# Altium schematic sheet 05-VIDEO_TEST_PATTERN.SchDoc
size B
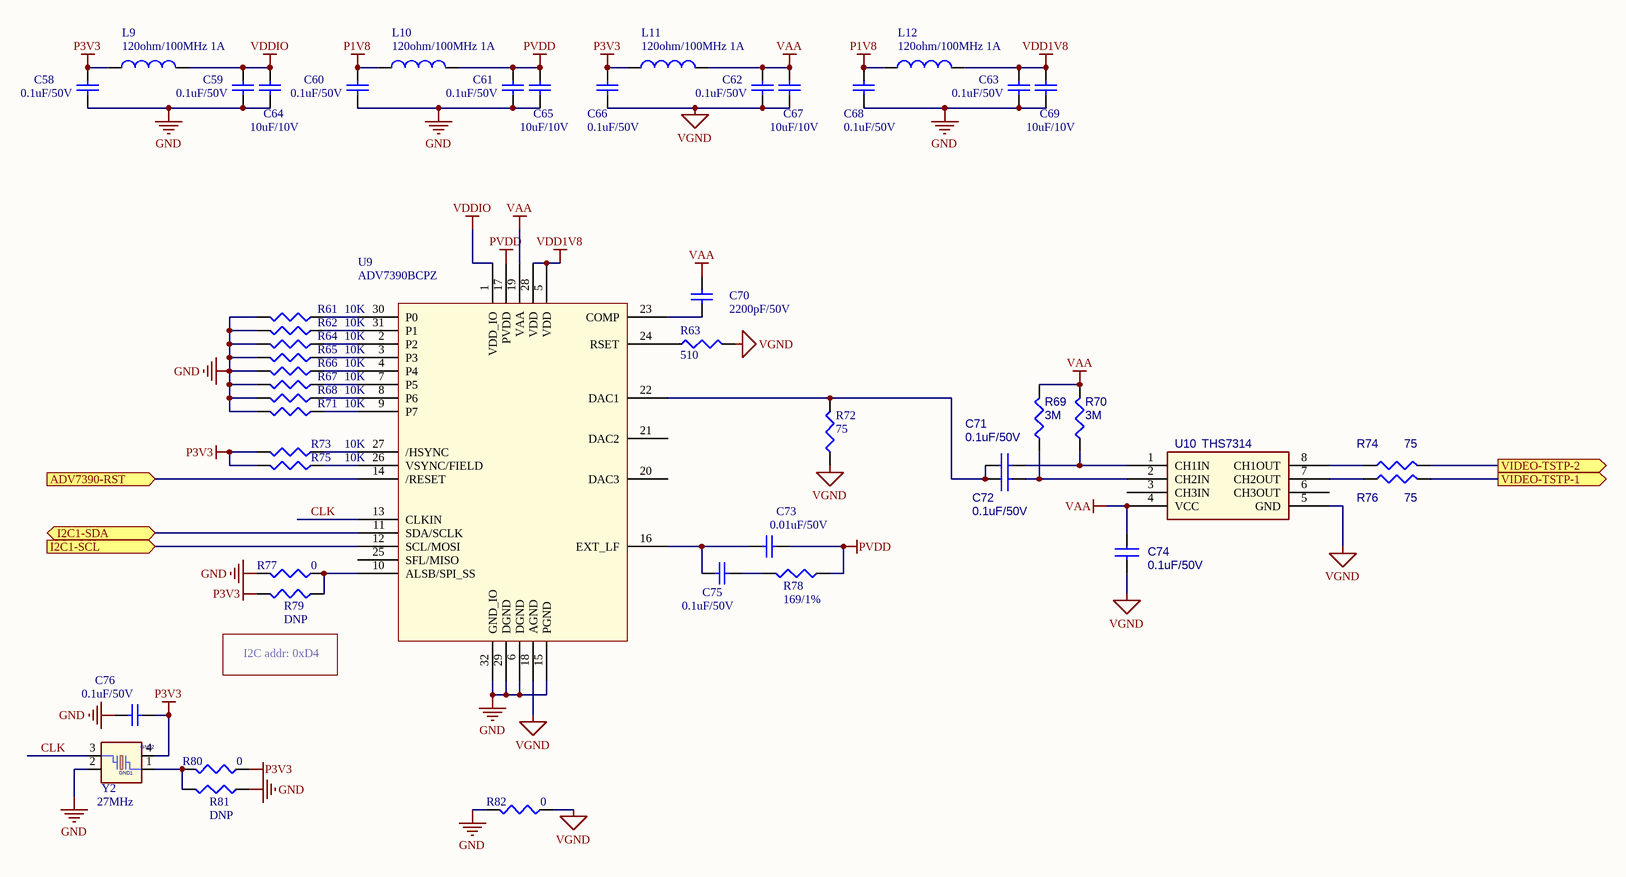
[diagram p0: 05-VIDEO_TEST_PATTERN.SchDoc]

## Parts
C58  0.1uF/50V  [0402]
C59  0.1uF/50V  [0402]
C60  0.1uF/50V  [0402]
C61  0.1uF/50V  [0402]
C62  0.1uF/50V  [0402]
C63  0.1uF/50V  [0402]
C64  10uF/10V  [0805]
C65  10uF/10V  [0805]
C66  0.1uF/50V  [0402]
C67  10uF/10V  [0805]
C68  0.1uF/50V  [0402]
C69  10uF/10V  [0805]
C70  2200pF/50V  [0402]
C71  0.1uF/50V  [0402]
C72  0.1uF/50V  [0402]
C73  0.01uF/50V  [0402]
C74  0.1uF/50V  [0402]
C75  0.1uF/50V  [0402]
C76  0.1uF/50V  [0402]
L9  120ohm/100MHz 1A  [0603]
L10  120ohm/100MHz 1A  [0603]
L11  120ohm/100MHz 1A  [0603]
L12  120ohm/100MHz 1A  [0603]
R61  10K  [0402]
R62  10K  [0402]
R63  510  [0402]
R64  10K  [0402]
R65  10K  [0402]
R66  10K  [0402]
R67  10K  [0402]
R68  10K  [0402]
R69  3M  [0402]
R70  3M  [0402]
R71  10K  [0402]
R72  75  [0402]
R73  10K  [0402]
R74  75  [0402]
R75  10K  [0402]
R76  75  [0402]
R77  0  [0402]
R78  169/1%  [0402]
R79  DNP  [0402]
R80  0  [0402]
R81  DNP  [0402]
R82  0  [0402]
U9  ADV7390BCPZ  [LFCSP32]
U10  THS7314  [so8]
Y2  27MHz  [XTAL4_SX_3225]

## Ports
ADV7390-RST (in), I2C1-SCL (in), I2C1-SDA (bidir), VIDEO-TSTP-1 (out), VIDEO-TSTP-2 (out)

## Nets
GND: C58.2 C59.2 C60.2 C61.2 C63.2 C64.2 C65.2 C68.2 C69.2 C76.2 R61.2 R62.2 R64.2 R65.2 R66.2 R67.2 R68.2 R71.2 R77.2 R81.1 R82.2 U9.6(DGND) U9.15(PGND) U9.29(DGND) U9.32(GND_IO) Y2.2(GND1)
P1V8: C60.1 C68.1 L10.1 L12.1
P3V3: C58.1 C66.1 C76.1 L9.1 L11.1 R73.2 R75.2 R79.2 R80.1 Y2.4(GND2)
PVDD: C61.1 C65.1 C73.2 L10.2 R78.1 U9.17(PVDD)
VAA: C62.1 C67.1 C70.1 C74.1 L11.2 R69.2 R70.2 U9.19(VAA) U10.4(VCC)
VDD1V8: C63.1 C69.1 L12.2 U9.5(VDD) U9.28(VDD)
VDDIO: C59.1 C64.1 L9.2 U9.1(VDD_IO)
VGND: C62.2 C66.2 C67.2 C74.2 R63.2 R72.1 R82.1 U9.18(AGND) U10.5(GND)
ADV7390-RST: U9.14(/RESET) ; port ADV7390-RST
CLK: U9.13(CLKIN) Y2.3
I2C1-SCL: U9.12(SCL/MOSI) ; port I2C1-SCL
I2C1-SDA: U9.11(SDA/SCLK) ; port I2C1-SDA
VIDEO-TSTP-1: R76.2 ; port VIDEO-TSTP-1
VIDEO-TSTP-2: R74.2 ; port VIDEO-TSTP-2
NetC70_2: C70.2 U9.23(COMP)
NetC71_1: C71.1 C72.1 R72.2 U9.22(DAC1)
NetC71_2: C71.2 R70.1 U10.1(CH1IN)
NetC72_2: C72.2 R69.1 U10.2(CH2IN)
NetC73_1: C73.1 C75.1 U9.16(EXT_LF)
NetC75_2: C75.2 R78.2
NetR61_1: R61.1 U9.30(P0)
NetR62_1: R62.1 U9.31(P1)
NetR63_1: R63.1 U9.24(RSET)
NetR64_1: R64.1 U9.2(P2)
NetR65_1: R65.1 U9.3(P3)
NetR66_1: R66.1 U9.4(P4)
NetR67_1: R67.1 U9.7(P5)
NetR68_1: R68.1 U9.8(P6)
NetR71_1: R71.1 U9.9(P7)
NetR73_1: R73.1 U9.27(/HSYNC)
NetR74_1: R74.1 U10.8(CH1OUT)
NetR75_1: R75.1 U9.26(VSYNC/FIELD)
NetR76_1: R76.1 U10.7(CH2OUT)
NetR77_1: R77.1 R79.1 U9.10(ALSB/SPI_SS)
NetR80_2: R80.2 R81.2 Y2.1

Not connected (* = marked no-connect by the designer): U9 20(DAC3) 21(DAC2) 25(SFL/MISO); U10 3(CH3IN) 6(CH3OUT)

## Notes on the sheet
- I2C addr: 0xD4

## Library data of the parts
C58-C70 C73 C75 C76 = Cap: Capacitor; Published: 8-Jun-2000; LatestRevisionDate: 17-Jul-2002; LatestRevisionNote: Re-released for DXP Platform.; PackageReference: RAD-0.3; Publisher: Altium Limited; PackageDescription: Radial Cap, Thru-Hole; 2 Leads; 0.3 in Pin Spacing
C71 C72 C74 = CAP
L9-L12 = Inductor: Code_IEC: 1005; Value: 300ohm/100MHz BEAD; Published: 8-Jun-2000; LatestRevisionDate: 29-May-2009; LatestRevisionNote: IPC-7351 Footprint Added.; PackageReference: 0402-A; Publisher: Altium Limited; PackageDescription: Chip Inductor; Code_JEITA: 0402
R61-R68 R71-R73 R75 R77-R82 = CR16-1003FM
R69 R70 R74 R76 = R: Manufacturer Part number: null; Part Description: S RES 1/16W 10K +-5% 0402; Part Number: SD02810028L; ROOM: SD; Deletion Flag: 0; Function Field: 32.3; Ecology: YES; Part Type: RESISTOR; AP Sheet: http://ISPDPRD/Windchill/servlet/WindchillAuthGW/wt.enterprise.URLProcessor/URLTemplateAction?u8&oid=VR%3Aext.compal.part.Comp; AP: AP; Lead Free: Y1
Y2 = CRYSTAL_JXS63: XTAL 28.63636MHZ 10PF RSN -- SMT; CLASS: IC; PRIORITY_PN: 048-00268; CAD_APPROVED: Yes; MFG_PN01: ABM3B-28.63636MHZ-10-1-U-T; MFG_NAME01: ABRACON CORP; AGILE_PN: 230-76635; HEIGHT: 1.1MM; ROHS: Yes